# Altium schematic sheet [3]-CPU.SchDoc
size A2
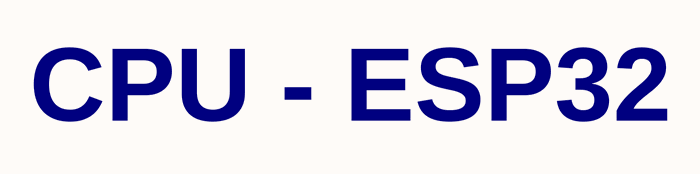
[diagram p0: [3]-CPU.SchDoc]

## Notes on the sheet
- CPU - ESP32